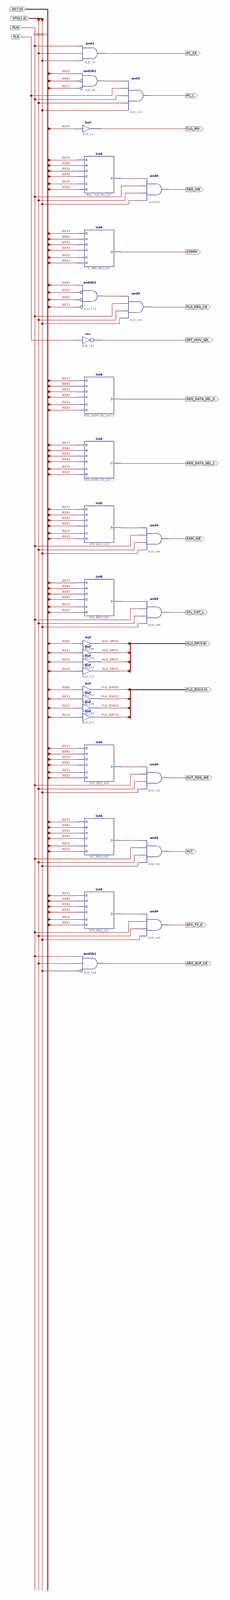
[diagram p0: schematic sheet 1, whole]
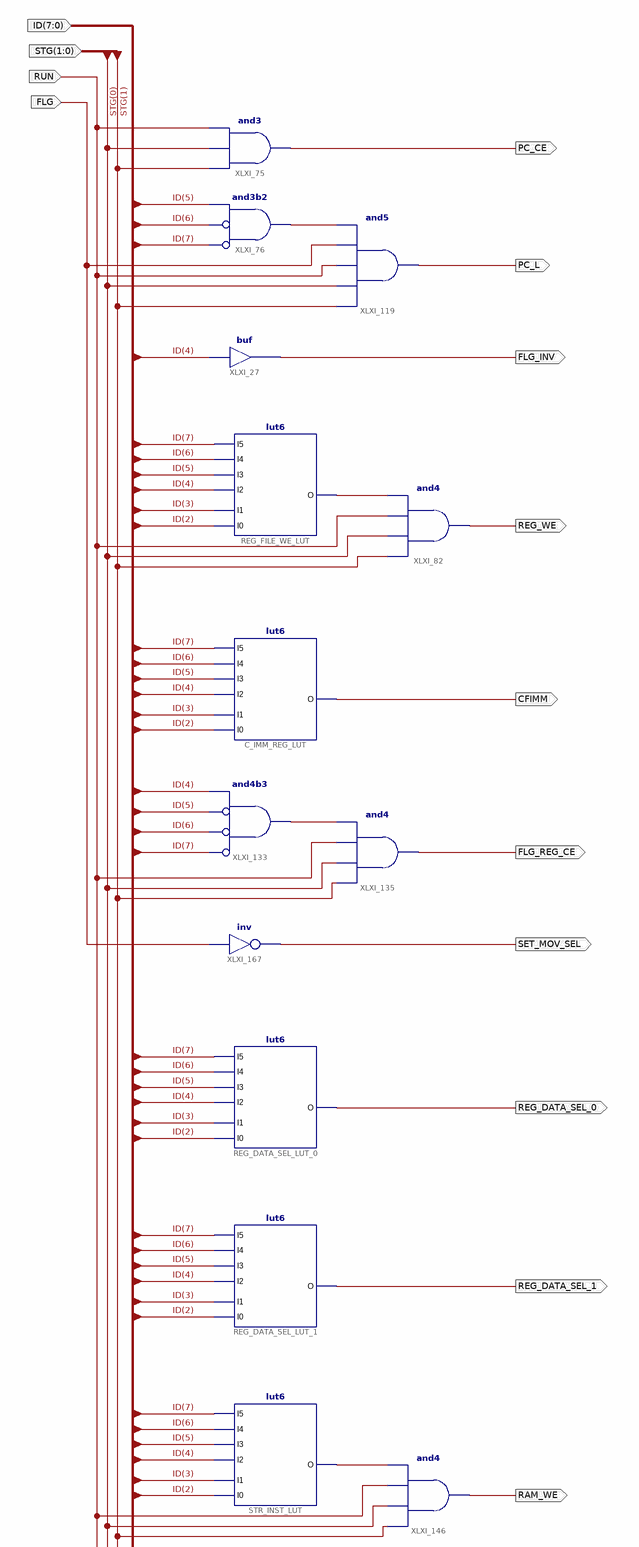
[diagram p1: schematic sheet 1, upper part]
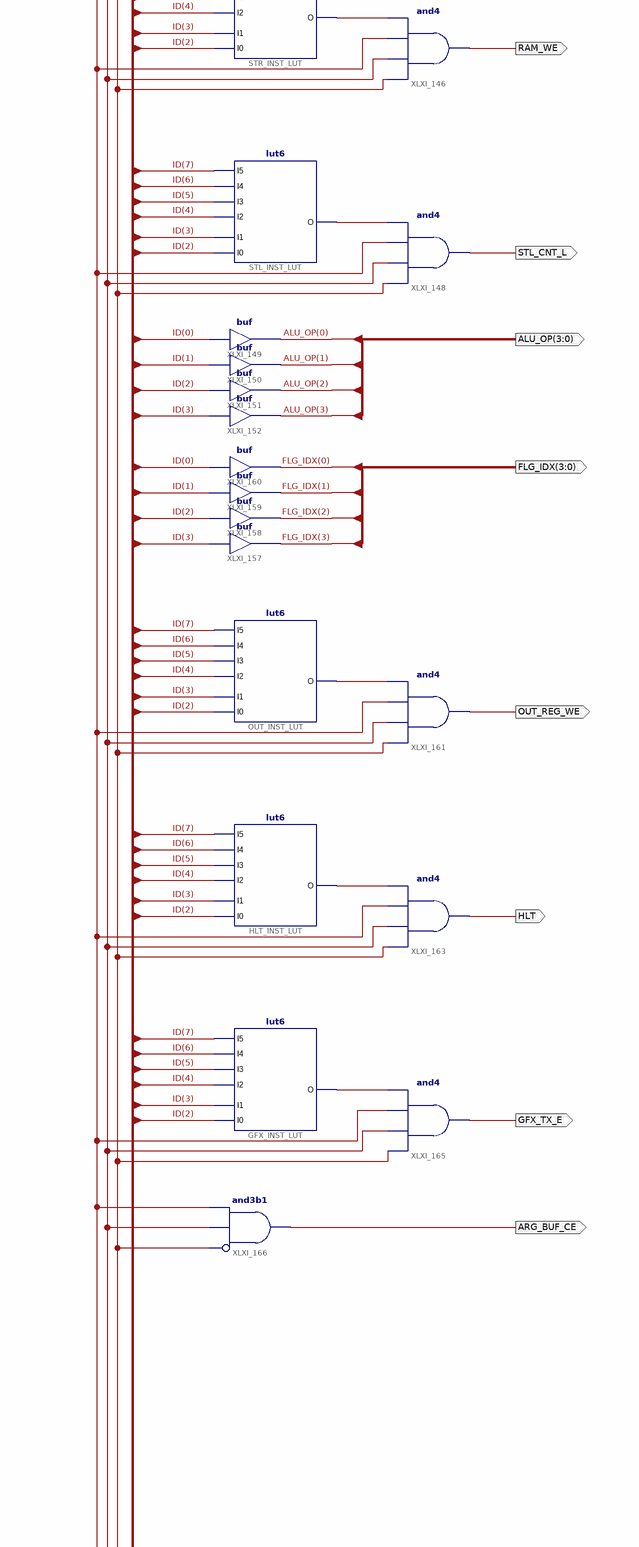
[diagram p2: schematic sheet 1, middle part]
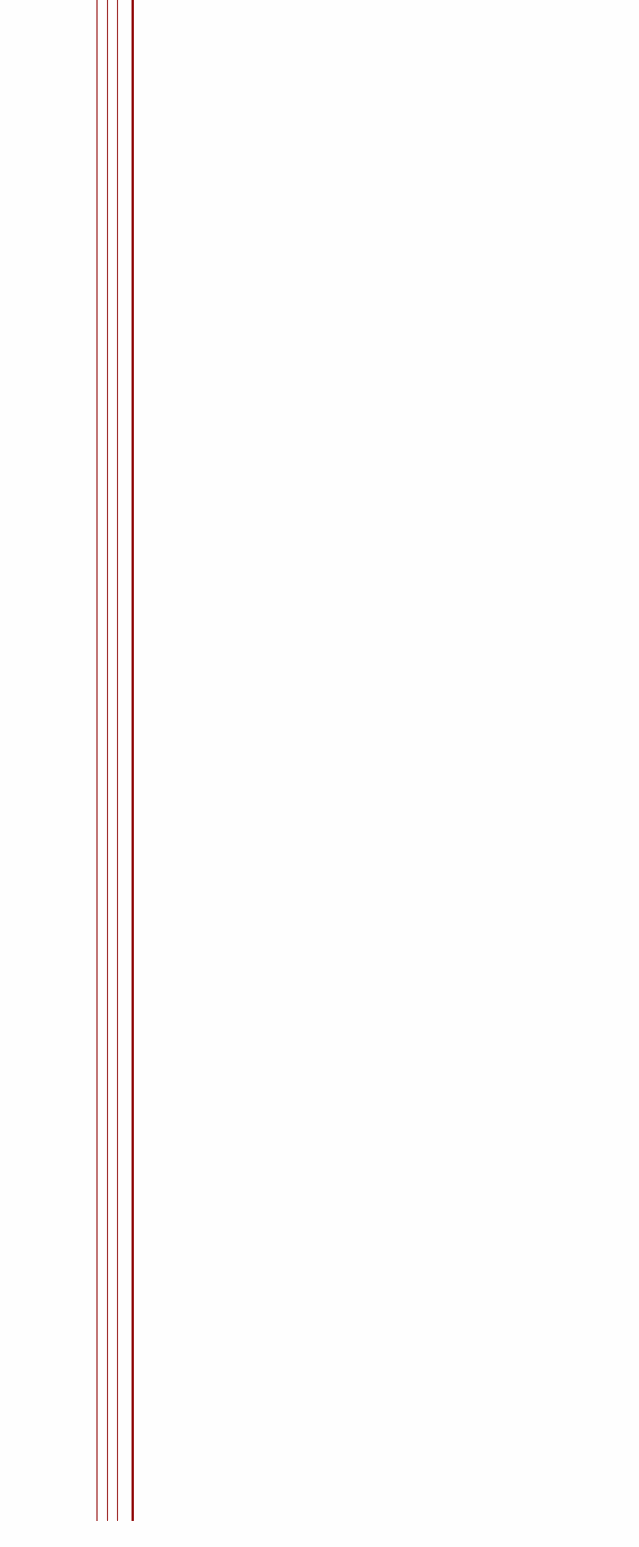
[diagram p3: schematic sheet 1, lower part]
// Xilinx ISE schematic cu.sch (spartan6) as structural Verilog: 31 symbols, 21 ports
module cu (
  input  [7:0] ID,
  input  RUN,
  input  FLG,
  input  [1:0] STG,
  output SET_MOV_SEL,
  output PC_CE,
  output FLG_INV,
  output REG_WE,
  output CFIMM,
  output PC_L,
  output FLG_REG_CE,
  output REG_DATA_SEL_0,
  output REG_DATA_SEL_1,
  output RAM_WE,
  output STL_CNT_L,
  output [3:0] ALU_OP,
  output [3:0] FLG_IDX,
  output OUT_REG_WE,
  output HLT,
  output GFX_TX_E,
  output ARG_BUF_CE
);

  wire XLXN_81, XLXN_184, XLXN_394, XLXN_406, XLXN_454, XLXN_456, XLXN_458, XLXN_460;

  and XLXI_75 (PC_CE, STG[1], STG[0], RUN);
  buf XLXI_27 (FLG_INV, ID[4]);
  lut6 #(.INIT("0005000000FF00F0")) REG_FILE_WE_LUT (
    .O(XLXN_81), .I0(ID[2]), .I1(ID[3]), .I2(ID[4]), .I3(ID[5]), .I5(ID[7]), .I4(ID[6]));
  and XLXI_82 (REG_WE, STG[1], STG[0], RUN, XLXN_81);
  lut6 #(.INIT("0040000000000000")) C_IMM_REG_LUT (
    .O(CFIMM), .I0(ID[2]), .I1(ID[3]), .I2(ID[4]), .I3(ID[5]), .I5(ID[7]), .I4(ID[6]));
  and XLXI_133 (XLXN_394, ~ID[7], ~ID[6], ~ID[5], ID[4]);  // and4b3
  and XLXI_135 (FLG_REG_CE, STG[1], STG[0], RUN, XLXN_394);
  and XLXI_119 (PC_L, STG[1], STG[0], RUN, FLG, XLXN_406);
  and XLXI_76 (XLXN_406, ~ID[7], ~ID[6], ID[5]);  // and3b2
  lut6 #(.INIT("0001000000FF0000")) REG_DATA_SEL_LUT_0 (
    .O(REG_DATA_SEL_0), .I0(ID[2]), .I1(ID[3]), .I2(ID[4]), .I3(ID[5]), .I5(ID[7]), .I4(ID[6]));
  lut6 #(.INIT("0004000000FF0000")) REG_DATA_SEL_LUT_1 (
    .O(REG_DATA_SEL_1), .I0(ID[2]), .I1(ID[3]), .I2(ID[4]), .I3(ID[5]), .I5(ID[7]), .I4(ID[6]));
  lut6 #(.INIT("0002000000000000")) STR_INST_LUT (
    .O(XLXN_184), .I0(ID[2]), .I1(ID[3]), .I2(ID[4]), .I3(ID[5]), .I5(ID[7]), .I4(ID[6]));
  and XLXI_146 (RAM_WE, STG[1], STG[0], RUN, XLXN_184);
  lut6 #(.INIT("0000000000000002")) STL_INST_LUT (
    .O(XLXN_454), .I0(ID[2]), .I1(ID[3]), .I2(ID[4]), .I3(ID[5]), .I5(ID[7]), .I4(ID[6]));
  and XLXI_148 (STL_CNT_L, STG[1], STG[0], RUN, XLXN_454);
  buf XLXI_152 (ALU_OP[3], ID[3]);
  buf XLXI_151 (ALU_OP[2], ID[2]);
  buf XLXI_150 (ALU_OP[1], ID[1]);
  buf XLXI_149 (ALU_OP[0], ID[0]);
  buf XLXI_157 (FLG_IDX[3], ID[3]);
  buf XLXI_158 (FLG_IDX[2], ID[2]);
  buf XLXI_159 (FLG_IDX[1], ID[1]);
  buf XLXI_160 (FLG_IDX[0], ID[0]);
  lut6 #(.INIT("0008000000000000")) OUT_INST_LUT (
    .O(XLXN_456), .I0(ID[2]), .I1(ID[3]), .I2(ID[4]), .I3(ID[5]), .I5(ID[7]), .I4(ID[6]));
  and XLXI_161 (OUT_REG_WE, STG[1], STG[0], RUN, XLXN_456);
  lut6 #(.INIT("0000000000000004")) HLT_INST_LUT (
    .O(XLXN_458), .I0(ID[2]), .I1(ID[3]), .I2(ID[4]), .I3(ID[5]), .I5(ID[7]), .I4(ID[6]));
  and XLXI_163 (HLT, STG[1], STG[0], RUN, XLXN_458);
  lut6 #(.INIT("0030000000000000")) GFX_INST_LUT (
    .O(XLXN_460), .I0(ID[2]), .I1(ID[3]), .I2(ID[4]), .I3(ID[5]), .I5(ID[7]), .I4(ID[6]));
  and XLXI_165 (GFX_TX_E, STG[1], STG[0], RUN, XLXN_460);
  and XLXI_166 (ARG_BUF_CE, ~STG[1], STG[0], RUN);  // and3b1
  not XLXI_167 (SET_MOV_SEL, FLG);
endmodule
